# Altium project buck_converter_v2.PrjPcb
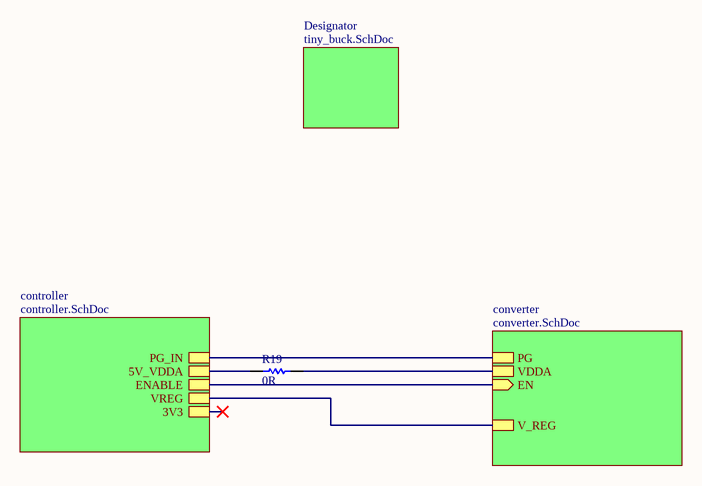
[diagram p0: COMBINED.SchDoc]
5 sheets, 97 parts. Net scope: hierarchical (ports join the sheet entries above them; power ports are global).
Board file: INTEGRATED_PCB.PcbDoc
Sheets:
  esc.SchDoc
  COMBINED.SchDoc
    converter = converter.SchDoc
    controller = controller.SchDoc
    Designator = tiny_buck.SchDoc

## Sheet esc.SchDoc
size A3; SheetNumber: 1; SheetTotal: 5

## Sheet COMBINED.SchDoc
size A3; SheetNumber: 2; SheetTotal: 5

### Parts
R19  value 0R  [SMD-0603-RES]  (hidden comment: Resistor)

### Sub-sheets
controller = controller.SchDoc: 5V_VDDA, ENABLE, VREG, 3V3, PG_IN
converter = converter.SchDoc: PG, EN (in), V_REG, VDDA
Designator = tiny_buck.SchDoc: no entries

### Nets
NetC4_1: R19.2 ; sheet converter/VDDA
NetC12_2: R19.1 ; sheet controller/5V_VDDA
NetIC3_19: sheet converter/PG, sheet controller/PG_IN
NetIC3_20: sheet converter/EN, sheet controller/ENABLE
NetQ1_3: sheet converter/V_REG, sheet controller/VREG

### Library data of the parts
R19 = Resistor: TC1: 0; SimulationGenericComponent: True; TC2: 0

## Sheet converter.SchDoc
size A3; SheetNumber: 3; SheetTotal: 5
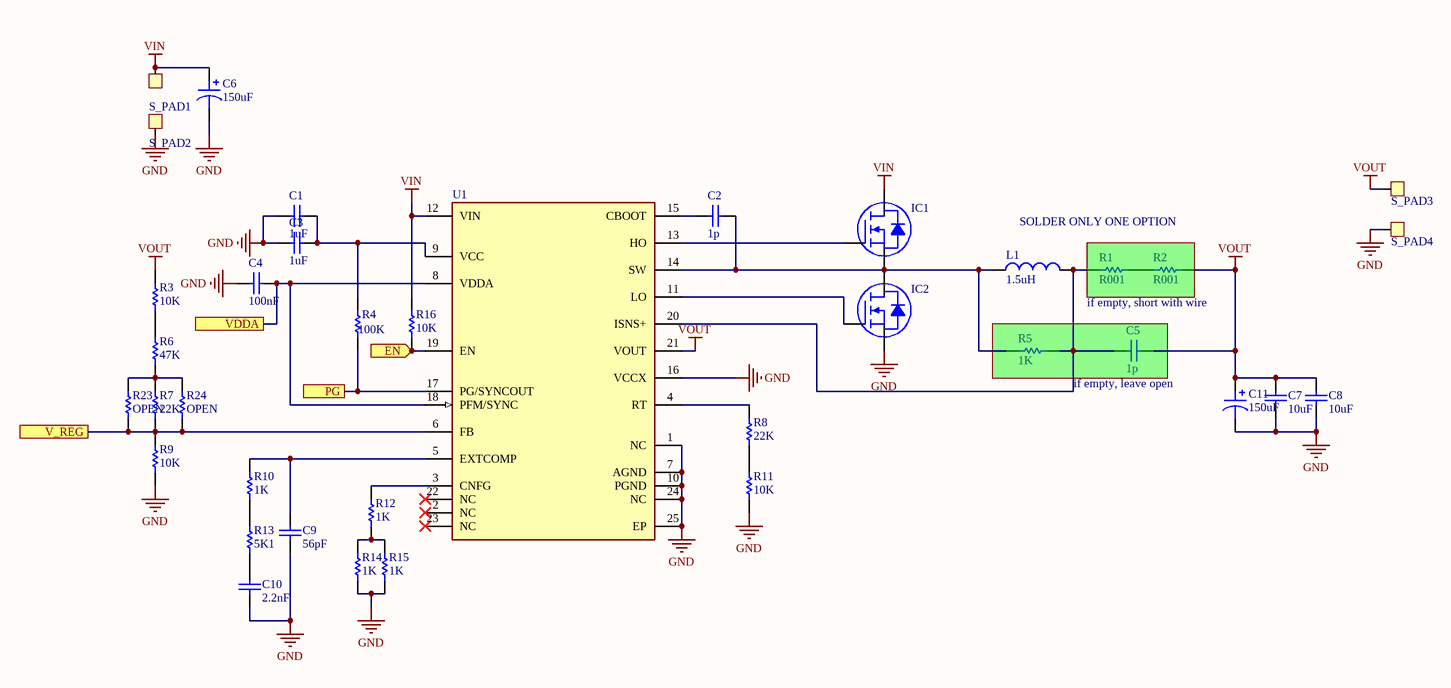
[diagram p1: converter.SchDoc]

### Parts
(Parts that share a designator on the sheet are numbered #1, #2 ... from top to bottom, then left to right.)
C1  value 1uF  [SMD-0603-RES]  (hidden comment: Capacitor)
C2  value 1p  [SMD-0603-RES]  (hidden comment: Capacitor)
C3  value 1uF  [SMD-0603-RES]  (hidden comment: Capacitor)
C4  value 100nF  [SMD-0603-RES]  (hidden comment: Capacitor)
C5  value 1p  [SMD-0603-RES]  (hidden comment: Capacitor)
C6  150uF  [CAPAE7266X80M]
C7  value 10uF  [SMD-0603-RES]  (hidden comment: Capacitor)
C8  value 10uF  [SMD-0603-RES]  (hidden comment: Capacitor)
C9  value 56pF  [SMD-0603-RES]  (hidden comment: Capacitor)
C10  value 2.2nF  [SMD-0603-RES]  (hidden comment: Capacitor)
C11  150uF  [CAPAE7266X80M]
IC1  MOSFET N-CH SOT-23-3  [DPAK228P1975X238-3N]  (value not drawn)
IC2  MOSFET N-CH SOT-23-3  [DPAK228P1975X238-3N]  (value not drawn)
L1  value 1.5uH  [INDP135127X65N]  (hidden comment: Inductor)
R1  value R001  [SMD-1206-RES]  (hidden comment: Resistor)
R2  value R001  [SMD-1206-RES]  (hidden comment: Resistor)
R3  value 10K  [SMD-0603-RES]  (hidden comment: Resistor)
R4  value 100K  [SMD-0603-RES]  (hidden comment: Resistor)
R5  value 1K  [SMD-0603-RES]  (hidden comment: Resistor)
R6  value 47K  [SMD-0603-RES]  (hidden comment: Resistor)
R7  value 22K  [SMD-0603-RES]  (hidden comment: Resistor)
R8  value 22K  [SMD-0603-RES]  (hidden comment: Resistor)
R9  value 10K  [SMD-0603-RES]  (hidden comment: Resistor)
R10  value 1K  [SMD-0603-RES]  (hidden comment: Resistor)
R11  value 10K  [SMD-0603-RES]  (hidden comment: Resistor)
R12  value 1K  [SMD-0603-RES]  (hidden comment: Resistor)
R13  value 5K1  [SMD-0603-RES]  (hidden comment: Resistor)
R14  value 1K  [SMD-0603-RES]  (hidden comment: Resistor)
R15  value 1K  [SMD-0603-RES]  (hidden comment: Resistor)
R16  value 10K  [SMD-0603-RES]  (hidden comment: Resistor)
R23#1  value OPEN  [SMD-0603-RES]  (hidden comment: Resistor)
R24#1  value OPEN  [SMD-0603-RES]  (hidden comment: Resistor)
S_PAD1  SOLDER_PAD  [POWER_PAD]  (value not drawn)
S_PAD2  SOLDER_PAD  [POWER_PAD]  (value not drawn)
S_PAD3  SOLDER_PAD  [POWER_PAD]  (value not drawn)
S_PAD4  SOLDER_PAD  [POWER_PAD]  (value not drawn)
U1  (no value)  [FP-RGY0024E-MFG]

### Blocks framed on the sheet
if empty, short with wire: C5 R5

### Ports
EN (in, see COMBINED[4B]), PG (see COMBINED[4B]), V_REG (see COMBINED[4B]), VDDA (see COMBINED[4B])

### Nets
GND: C1.1 C3.1 C4.2 C6.2 C7.1 C8.1 C9.1 C10.2 C11.2 IC2.3(S) R9.1 R11.2 R14.2 R15.2 S_PAD2.1 S_PAD4.1 U1.1(NC) U1.7(AGND) U1.10(PGND) U1.16(VCCX) U1.24(NC) U1.25(EP)
VIN: C6.1 IC1.2(D) R16.2 S_PAD1.1 U1.12(VIN)
VOUT: C5.2 C7.2 C8.2 C11.1 R2.2 R3.2 S_PAD3.1 U1.21(VOUT)
NetC1_2: C1.2 C3.2 R4.2 U1.9(VCC)
NetC2_1: C2.1 IC1.3(S) IC2.2(D) L1.1 R5.1 U1.14(SW)
NetC2_2: C2.2 U1.15(CBOOT)
NetC4_1: C4.1 U1.8(VDDA) U1.18(PFM/SYNC) ; port VDDA
NetC5_1: C5.1 L1.2 R1.1 R5.2 U1.20(ISNS+)
NetC9_2: C9.2 R10.2 U1.5(EXTCOMP)
NetC10_1: C10.1 R13.1
NetIC1_1: IC1.1(G) U1.13(HO)
NetIC2_1: IC2.1(G) U1.11(LO)
NetIC3_19: R4.1 U1.17(PG/SYNCOUT) ; port PG
NetIC3_20: R16.1 U1.19(EN) ; port EN
NetQ1_3: R7.1 R9.2 R23#1.1 R24#1.1 U1.6(FB) ; port V_REG
NetR1_2: R1.2 R2.1
NetR3_1: R3.1 R6.2
NetR6_1: R6.1 R7.2 R23#1.2 R24#1.2
NetR8_1: R8.1 R11.1
NetR8_2: R8.2 U1.4(RT)
NetR10_1: R10.1 R13.2
NetR12_1: R12.1 U1.3(CNFG)
NetR12_2: R12.2 R14.1 R15.1

Not connected (* = marked no-connect by the designer): U1 2(NC)* 22(NC)* 23(NC)*

### Notes on the sheet
- SOLDER ONLY ONE OPTION
- if empty, leave open

### Library data of the parts
C1-C5 C7-C10 = Capacitor: SimulationGenericComponent: True
C6 C11 = Polarised Capacitor: SMT Polarised Capacitor; Value: 150uF
IC1 IC2 = DIODES INC MOSFET N-CH SOT-23-3
L1 = Inductor: DMBJ CXP1040-1R5M-AG(1.5uh); SimulationGenericComponent: True
R1 R2 = Resistor: 1mOhm current sense; TC1: 0; SimulationGenericComponent: True; TC2: 0
R3-R16 R23#1 R24#1 = Resistor: TC1: 0; SimulationGenericComponent: True; TC2: 0
U1 = CMP-00370-134525155-1: LM5148QRGYRQ1 Automotive, 80-V synchronous buck DC/DC controller with ultra-low IQ 24-VQFN -40 to 125; Manufacturer Lifecycle Status: ACTIVE; Case/Package: VQFN; Number of Pins: 24; Length: 5.5mm; Width: 3.5mm; Thickness: 900µm; NexarPartId: 134525155; Lifecycle Status: Production; Height: 1mm

## Sheet controller.SchDoc
size A3; SheetNumber: 4; SheetTotal: 5
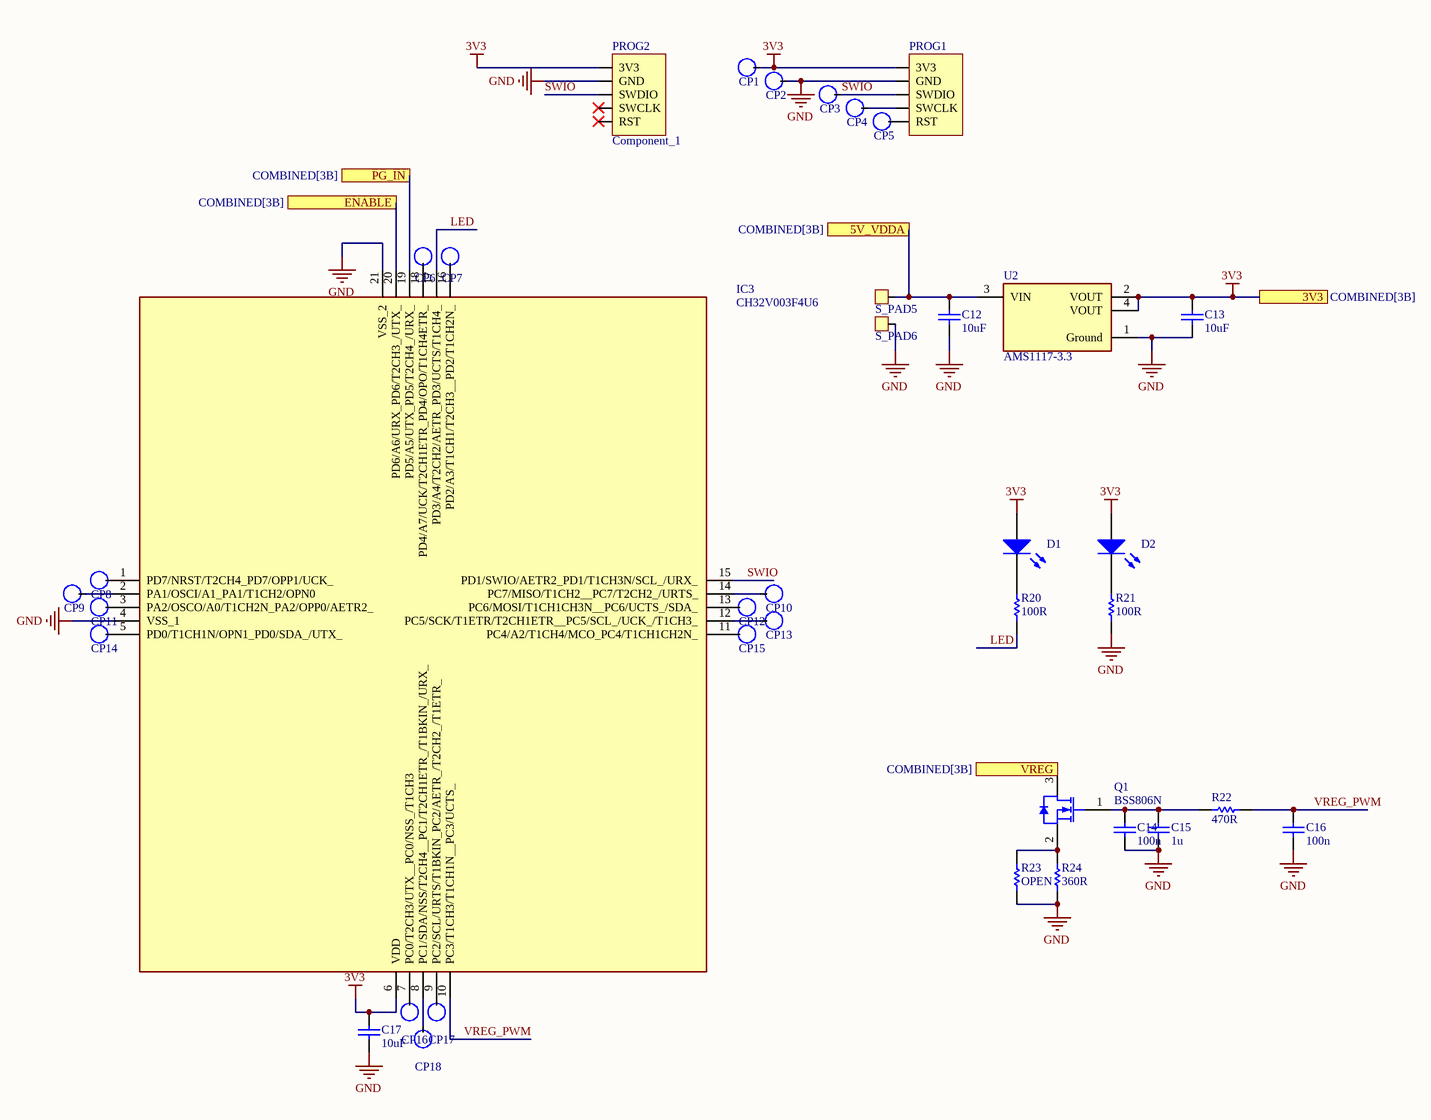
[diagram p2: controller.SchDoc]

### Parts
(Parts that share a designator on the sheet are numbered #1, #2 ... from top to bottom, then left to right.)
C12  value 10uF  [SMD-0603-RES]  (hidden comment: Capacitor)
C13  value 10uF  [SMD-0603-RES]  (hidden comment: Capacitor)
C14  value 100n  [CAP FILM 0603_1608]  (hidden comment: Capacitor)
C15  value 1u  [CAP FILM 0603_1608]  (hidden comment: Capacitor)
C16  value 100n  [CAP FILM 0603_1608]  (hidden comment: Capacitor)
C17  value 10uF  [SMD-0603-RES]  (hidden comment: Capacitor)
CP1  CONNECT_PAD  [PAD_SQUARE]  (value not drawn)
CP2  CONNECT_PAD  [PAD_SQUARE]  (value not drawn)
CP3  CONNECT_PAD  [PAD_SQUARE]  (value not drawn)
CP4  CONNECT_PAD  [PAD_SQUARE]  (value not drawn)
CP5  CONNECT_PAD  [PAD_SQUARE]  (value not drawn)
CP6  CONNECT_PAD  [PAD_SQUARE]  (value not drawn)
CP7  CONNECT_PAD  [PAD_SQUARE]  (value not drawn)
CP8  CONNECT_PAD  [PAD_SQUARE]  (value not drawn)
CP9  CONNECT_PAD  [PAD_SQUARE]  (value not drawn)
CP10  CONNECT_PAD  [PAD_SQUARE]  (value not drawn)
CP11  CONNECT_PAD  [PAD_SQUARE]  (value not drawn)
CP12  CONNECT_PAD  [PAD_SQUARE]  (value not drawn)
CP13  CONNECT_PAD  [PAD_SQUARE]  (value not drawn)
CP14  CONNECT_PAD  [PAD_SQUARE]  (value not drawn)
CP15  CONNECT_PAD  [PAD_SQUARE]  (value not drawn)
CP16  CONNECT_PAD  [PAD_SQUARE]  (value not drawn)
CP17  CONNECT_PAD  [PAD_SQUARE]  (value not drawn)
CP18  CONNECT_PAD  [PAD_SQUARE]  (value not drawn)
D1  Light-Emitting Diode  [SMD-0603-RES]  (value not drawn)
D2  Light-Emitting Diode  [SMD-0603-RES]  (value not drawn)
IC3  CH32V003F4U6  [QFN40P300X300X80-21N-D]
PROG1  Component_1  [programming_pad]  (value not drawn)
PROG2  Component_1  [programming_pad]
Q1  BSS806N  [INF-PG-SOT23_N]
R20  value 100R  [SMD-0603-RES]  (hidden comment: Resistor)
R21  value 100R  [SMD-0603-RES]  (hidden comment: Resistor)
R22  value 470R  [RES 0603_1608]  (hidden comment: Resistor)
R23#2  value OPEN  [RES 0603_1608]  (hidden comment: Resistor)
R24#2  value 360R  [RES 0603_1608]  (hidden comment: Resistor)
S_PAD5  SOLDER_PAD  [PAD_SQUARE]  (value not drawn)
S_PAD6  SOLDER_PAD  [PAD_SQUARE]  (value not drawn)
U2  AMS1117-3.3  [FP-AMS1117-IPC_C]

### Ports
3V3 (see COMBINED[3B]), 5V_VDDA (see COMBINED[3B]), ENABLE (see COMBINED[3B]), PG_IN (see COMBINED[3B]), VREG (see COMBINED[3B])

### Nets
3V3: C13.2 C17.2 CP1.1 D1.1(A) D2.1(A) IC3.6(VDD) PROG1.1(3V3) PROG2.1(3V3) U2.2(VOUT) U2.4(VOUT) ; port 3V3
GND: C12.1 C13.1 C14.1 C15.1 C16.1 C17.1 CP2.1 IC3.4(VSS_1) IC3.21(VSS_2) PROG1.2(GND) PROG2.2(GND) R21.1 R23#2.1 R24#2.1 S_PAD6.1 U2.1(Ground)
LED: IC3.17(PD3/A4/T2CH2/AETR_PD3/UCTS/T1CH4_) R20.1
SWIO: CP3.1 IC3.15(PD1/SWIO/AETR2_PD1/T1CH3N/SCL_/URX_) PROG1.4(SWDIO) PROG2.4(SWDIO)
VREG_PWM: C16.2 IC3.10(PC3/T1CH3/T1CH1N__PC3/UCTS_) R22.2
NetC12_2: C12.2 S_PAD5.1 U2.3(VIN) ; port 5V_VDDA
NetC14_2: C14.2 C15.2 Q1.1(GATE) R22.1
NetCP4_1: CP4.1 PROG1.3(SWCLK)
NetCP5_1: CP5.1 PROG1.5(RST)
NetCP6_1: CP6.1 IC3.18(PD4/A7/UCK/T2CH1ETR_PD4/OPO/T1CH4ETR_)
NetCP7_1: CP7.1 IC3.16(PD2/A3/T1CH1/T2CH3__PD2/T1CH2N_)
NetCP8_1: CP8.1 IC3.1(PD7/NRST/T2CH4_PD7/OPP1/UCK_)
NetCP9_1: CP9.1 IC3.2(PA1/OSCI/A1_PA1/T1CH2/OPN0)
NetCP10_1: CP10.1 IC3.14(PC7/MISO/T1CH2__PC7/T2CH2_/URTS_)
NetCP11_1: CP11.1 IC3.3(PA2/OSCO/A0/T1CH2N_PA2/OPP0/AETR2_)
NetCP12_1: CP12.1 IC3.13(PC6/MOSI/T1CH1CH3N__PC6/UCTS_/SDA_)
NetCP13_1: CP13.1 IC3.12(PC5/SCK/T1ETR/T2CH1ETR__PC5/SCL_/UCK_/T1CH3_)
NetCP14_1: CP14.1 IC3.5(PD0/T1CH1N/OPN1_PD0/SDA_/UTX_)
NetCP15_1: CP15.1 IC3.11(PC4/A2/T1CH4/MCO_PC4/T1CH1CH2N_)
NetCP16_1: CP16.1 IC3.7(PC0/T2CH3/UTX__PC0/NSS_/T1CH3)
NetCP17_1: CP17.1 IC3.9(PC2/SCL/URTS/T1BKIN_PC2/AETR_/T2CH2_/T1ETR_)
NetCP18_1: CP18.1 IC3.8(PC1/SDA/NSS/T2CH4__PC1/T2CH1ETR_/T1BKIN_/URX_)
NetD1_2: D1.2(K) R20.2
NetD2_2: D2.2(K) R21.2
NetIC3_19: IC3.19(PD5/A5/UTX_PD5/T2CH4_/URX_) ; port PG_IN
NetIC3_20: IC3.20(PD6/A6/URX_PD6/T2CH3_/UTX_) ; port ENABLE
NetQ1_2: Q1.2(SOURCE) R23#2.2 R24#2.2
NetQ1_3: Q1.3(DRAIN) ; port VREG

Not connected (* = marked no-connect by the designer): PROG2 3(SWCLK)* 5(RST)*

### Library data of the parts
C12-C17 = Capacitor: SimulationGenericComponent: True
D1 D2 = LED: AF: 1; BV: 0; BV_MAX: 1e99; EG: 1.11; FC: 0.5; IBV: 0.001; IS: 1e-14; MJSW: 0.33; NTUN: 30; TNOM: 27; XTI: 3; SimulationGenericComponent: True; CJO: 0; CJP: 0; CTA: 0; CTP: 0; FCS: 0.5; FV_MAX: 1e99; IKF: 0; IKR: 0; ISR: 1e-14; JSW: 0; JTUN: 0; JTUNSW: 0; KEG: 1; KF: 0; LEVEL: 1; N: 1; NBV: 1; NR: 1; NS: 1; PHP: 1; RS: 0; TCV: 0; TLEV: 0; TLEVC: 0; TM1: 0; TM2: 0; TPB: 0; TPHP: 0; TRS: 0; TRS2: 0; TT: 0; TTT1: 0; TTT2: 0; VJ: 1; XTITUN: 3
IC3 = CH32V003F4U6: Integrated Circuit; Manufacturer_Name: WCH; Datasheet Link: https://www.lcsc.com/datasheet/lcsc_datasheet_2409280202_WCH-Jiangsu-Qin-Heng-CH32V003F4U6_C5299908.pdf; Height: 0.8mm; Manufacturer_Part_Number: CH32V003F4U6
Q1 = CMP-1149-00036-1: N-Channel OptiMOS 2 Small-Signal-Transistor, 20 V VDS, 2.3 A ID, -55 to 150 degC, PG-SOT23, Reel, Green; Manufacturer: Infineon; VDS (max): 20 V; RthJA (max): 250 K/W; VGS(th) (max): 0.75Â V; QG: 1.7Â nC; RDS (on) (max) (@2.5V): 57 mOhm; VGS(th) (min): 0.3Â V; Ptot (max): 0.5Â W; Green: TRUE; IDpuls (max): 9.3Â A; ID (max): 2.3Â A; RDS (on) (max) (@1.8V): 82 mOhm; Halogen-free: TRUE; PackageVersion: Apr-08; PackageReference: PG-SOT23; PackageDescription: 3-Pin Small Outline Transistor Package, 2.9 x 1.3 mm Body, 0.95 mm Pitch; ComponentLink3URL: http://www.infineon.com/dgdl/SOT23-Package_Overview.pdf?folderId=db3a30431936bc4b0119532290053c66&fileId=db3a30431936bc4b0119533468123c85; ComponentLink3Description: Package Specification; ComponentLink2Description: Datasheet; Packing: Reel; Mounting Technology: Surface Mount; PartNumber: BSS806N; RDS (on) (max): 57 mOhm; ComponentLink2URL: http://www.infineon.com/dgdl/BSS806N_Rev2.3_.pdf?folderId=db3a3043156fd573011622e10b5c1f67&fileId=db3a304330f686060131185f0553451c; ComponentLink1URL: http://www.infineon.com/; ComponentLink1Description: Manufacturer URL; DatasheetVersion: Rev. 2.3
R20-R22 R23#2 R24#2 = Resistor: TC1: 0; SimulationGenericComponent: True; TC2: 0
U2 = CMP-209535-000001-1: LDO Voltage Regulators 1A, 3.3V; Manufacturer: Advanced Monolithic Systems; Dropout Voltage: 1.1V; Output Type: Fixed; Nominal Supply Current: 5mA; Max Power Dissipation: 1.2W; Max Supply Voltage: 15V; Number Of Outputs: 1; Standoff Height: 0.64mm; Max Junction Temp: +125°C; Height: 1.8mm; Package: AMS1117; Device Class L2: Power Management ICs; ComponentLink2Description: Datasheet; ComponentLink2URL: http://www.advanced-monolithic.com/pdf/ds1117.pdf; Category: IC; RoHS: TRUE; Automotive: No; Device Class L1: Integrated Circuits (ICs); Output Current: 1A; Device Class L3: Voltage Regulators - Linear; Temperature: -40°C to +125°C; Output Voltage: 3.3V; Manufacturer Part Number: AMS1117-3.3; Temperature Range Low: -40°C; Octopart: https://octopart.com/ams1117-3.3-advanced+monolithic+systems-25899300; Lead Free: Yes; Ipc Land Pattern Name: SOT229P700X180-4; Temperature Range High: +125°C

## Sheet tiny_buck.SchDoc
size A3; SheetNumber: 5; SheetTotal: 5
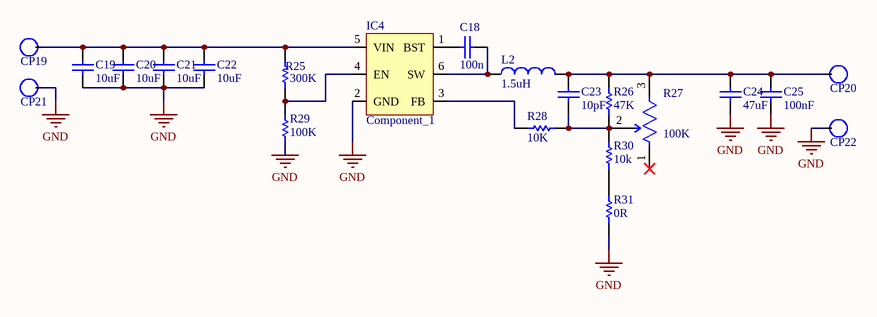
[diagram p3: tiny_buck.SchDoc]

### Parts
C18  value 100n  [SMD-0603-RES]  (hidden comment: Capacitor)
C19  value 10uF  [SMD-0603-RES]  (hidden comment: Capacitor)
C20  value 10uF  [SMD-0603-RES]  (hidden comment: Capacitor)
C21  value 10uF  [SMD-0603-RES]  (hidden comment: Capacitor)
C22  value 10uF  [SMD-0603-RES]  (hidden comment: Capacitor)
C23  value 10pF  [SMD-0603-RES]  (hidden comment: Capacitor)
C24  value 47uF  [SMD-0805-RES]  (hidden comment: Capacitor)
C25  value 100nF  [SMD-0603-RES]  (hidden comment: Capacitor)
CP19  CONNECT_PAD  [ROUND_SMALL]  (value not drawn)
CP20  CONNECT_PAD  [ROUND_SMALL]  (value not drawn)
CP21  CONNECT_PAD  [ROUND_SMALL]  (value not drawn)
CP22  CONNECT_PAD  [ROUND_SMALL]  (value not drawn)
IC4  Component_1  [SOT95P280X130-6N]
L2  value 1.5uH  [SMD-1206-RES]  (hidden comment: Cybermax CMLO252010F1R5MTT)
R25  value 300K  [SMD-0603-RES]  (hidden comment: Resistor)
R26  value 47K  [SMD-0603-RES]  (hidden comment: Resistor)
R27  Resistance: 100K  [FP-TC33X-2-MFG]  (hidden comment: TC33X-2-104E)
R28  value 10K  [SMD-0603-RES]  (hidden comment: Resistor)
R29  value 100K  [SMD-0603-RES]  (hidden comment: Resistor)
R30  value 10k  [SMD-0603-RES]  (hidden comment: Resistor)
R31  value 0R  [SMD-0603-RES]  (hidden comment: Resistor)

### Nets
GND: C19.1 C20.1 C21.1 C22.1 C24.1 C25.1 CP21.1 CP22.1 IC4.2(GND) R29.2 R31.1
NetC18_1: C18.1 IC4.6(SW) L2.1
NetC18_2: C18.2 IC4.1(BST)
NetC19_2: C19.2 C20.2 C21.2 C22.2 CP19.1 IC4.5(VIN) R25.2
NetC23_1: C23.1 R26.1 R27.2(WIPER) R28.1 R30.2
NetC23_2: C23.2 C24.2 C25.2 CP20.1 L2.2 R26.2 R27.3(CW)
NetIC4_3: IC4.3(FB) R28.2
NetIC4_4: IC4.4(EN) R25.1 R29.1
NetR30_1: R30.1 R31.2

Not connected (* = marked no-connect by the designer): R27 1(CCW)*

### Library data of the parts
C18-C25 = Capacitor: SimulationGenericComponent: True
L2 = Inductor: SimulationGenericComponent: True
R25 R26 R28-R31 = Resistor: TC1: 0; SimulationGenericComponent: True; TC2: 0
R27 = CMP-07234-000040-1: TRIMMER 100K OHM 0.1W J LEAD TOP; Number of Turns: 1; Voltage Rating (DC): 50V; Power Rating: 100mW; Resistance Tolerance: 25%; Temperature Coefficient: 250ppm/°C; Max Operating Temperature: 100°C; Package Quantity: 2500; REACH SVHC: No SVHC; Termination: Foot Print; Packaging: Tape and Reel; RoHS Compliant: Yes; Military Standard: Not; Color: Silver; Width: 0.118inch; Min Operating Temperature: -40°C; Mount: Surface Mount; Height: 0.047inch; Tolerance: 25%; Resistor Type: Carbon; Length: 3mm; Depth: 3.8mm; Weight: 29.4mg; Max Power Dissipation: 100mW; Series: TC33; Radiation Hardening: No

## Nets that join several sheets
GND: converter (22 pins), controller (16 pins), tiny_buck (11 pins)
NetC4_1: COMBINED (R19.2), converter (C4.1 U1.8 U1.18)
NetC12_2: COMBINED (R19.1), controller (C12.2 S_PAD5.1 U2.3)
NetIC3_19: converter (R4.1 U1.17), controller (IC3.19)
NetIC3_20: converter (R16.1 U1.19), controller (IC3.20)
NetQ1_3: converter (5 pins), controller (Q1.3)